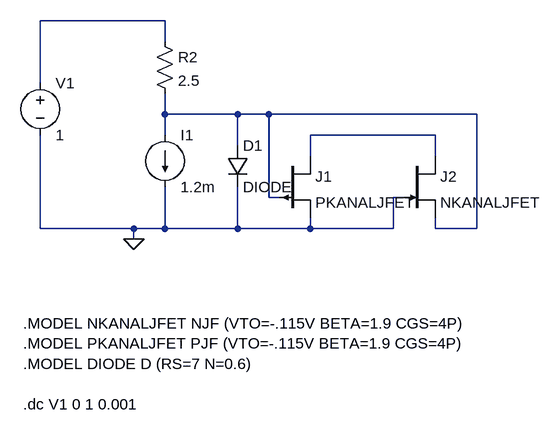
[diagram p0: schematic d1n3858.asc]
d1n3858.asc, the LTspice schematic file:
Version 4
SHEET 1 880 680
WIRE 96 -432 -96 -432
WIRE 96 -400 96 -432
WIRE -96 -336 -96 -432
WIRE 96 -288 96 -320
WIRE 208 -288 96 -288
WIRE 256 -288 208 -288
WIRE 576 -288 256 -288
WIRE 96 -256 96 -288
WIRE 512 -256 320 -256
WIRE 208 -240 208 -288
WIRE 320 -224 320 -256
WIRE 512 -224 512 -256
WIRE 256 -160 256 -288
WIRE 272 -160 256 -160
WIRE 464 -160 448 -160
WIRE -96 -112 -96 -256
WIRE 48 -112 -96 -112
WIRE 96 -112 96 -176
WIRE 96 -112 48 -112
WIRE 208 -112 208 -176
WIRE 208 -112 96 -112
WIRE 320 -112 320 -128
WIRE 320 -112 208 -112
WIRE 448 -112 448 -160
WIRE 448 -112 320 -112
WIRE 512 -112 512 -128
WIRE 576 -112 576 -288
WIRE 576 -112 512 -112
WIRE 48 -96 48 -112
FLAG 48 -96 0
SYMBOL PJF 272 -224 R0
SYMATTR InstName J1
SYMATTR Value PKANALJFET
SYMBOL NJF 464 -224 R0
SYMATTR InstName J2
SYMATTR Value NKANALJFET
SYMBOL res 80 -416 R0
SYMATTR InstName R2
SYMATTR Value 2.5
SYMBOL current 96 -256 R0
WINDOW 123 0 0 Left 2
WINDOW 39 0 0 Left 2
SYMATTR InstName I1
SYMATTR Value 1.2m
SYMBOL diode 192 -240 R0
SYMATTR InstName D1
SYMATTR Value DIODE
SYMBOL voltage -96 -352 R0
WINDOW 123 0 0 Left 2
WINDOW 39 0 0 Left 2
SYMATTR InstName V1
SYMATTR Value 1
TEXT -122 34 Left 2 !.MODEL NKANALJFET NJF (VTO=-.115V BETA=1.9 CGS=4P)\n.MODEL PKANALJFET PJF (VTO=-.115V BETA=1.9 CGS=4P)\n.MODEL DIODE D (RS=7 N=0.6)\n \n.dc V1 0 1 0.001

The netlist it stands for:
* d1n3858.asc
J1 N003 N002 0 PKANALJFET
J2 N003 0 N002 NKANALJFET
R2 N001 N002 2.5
I1 N002 0 1.2m
D1 N002 0 DIODE
V1 N001 0 1
.model D D
.lib standard.dio
.model NJF NJF
.model PJF PJF
.lib standard.jft
.MODEL NKANALJFET NJF (VTO=-.115V BETA=1.9 CGS=4P)
.MODEL PKANALJFET PJF (VTO=-.115V BETA=1.9 CGS=4P)
.MODEL DIODE D (RS=7 N=0.6)
.dc V1 0 1 0.001
.backanno
.end